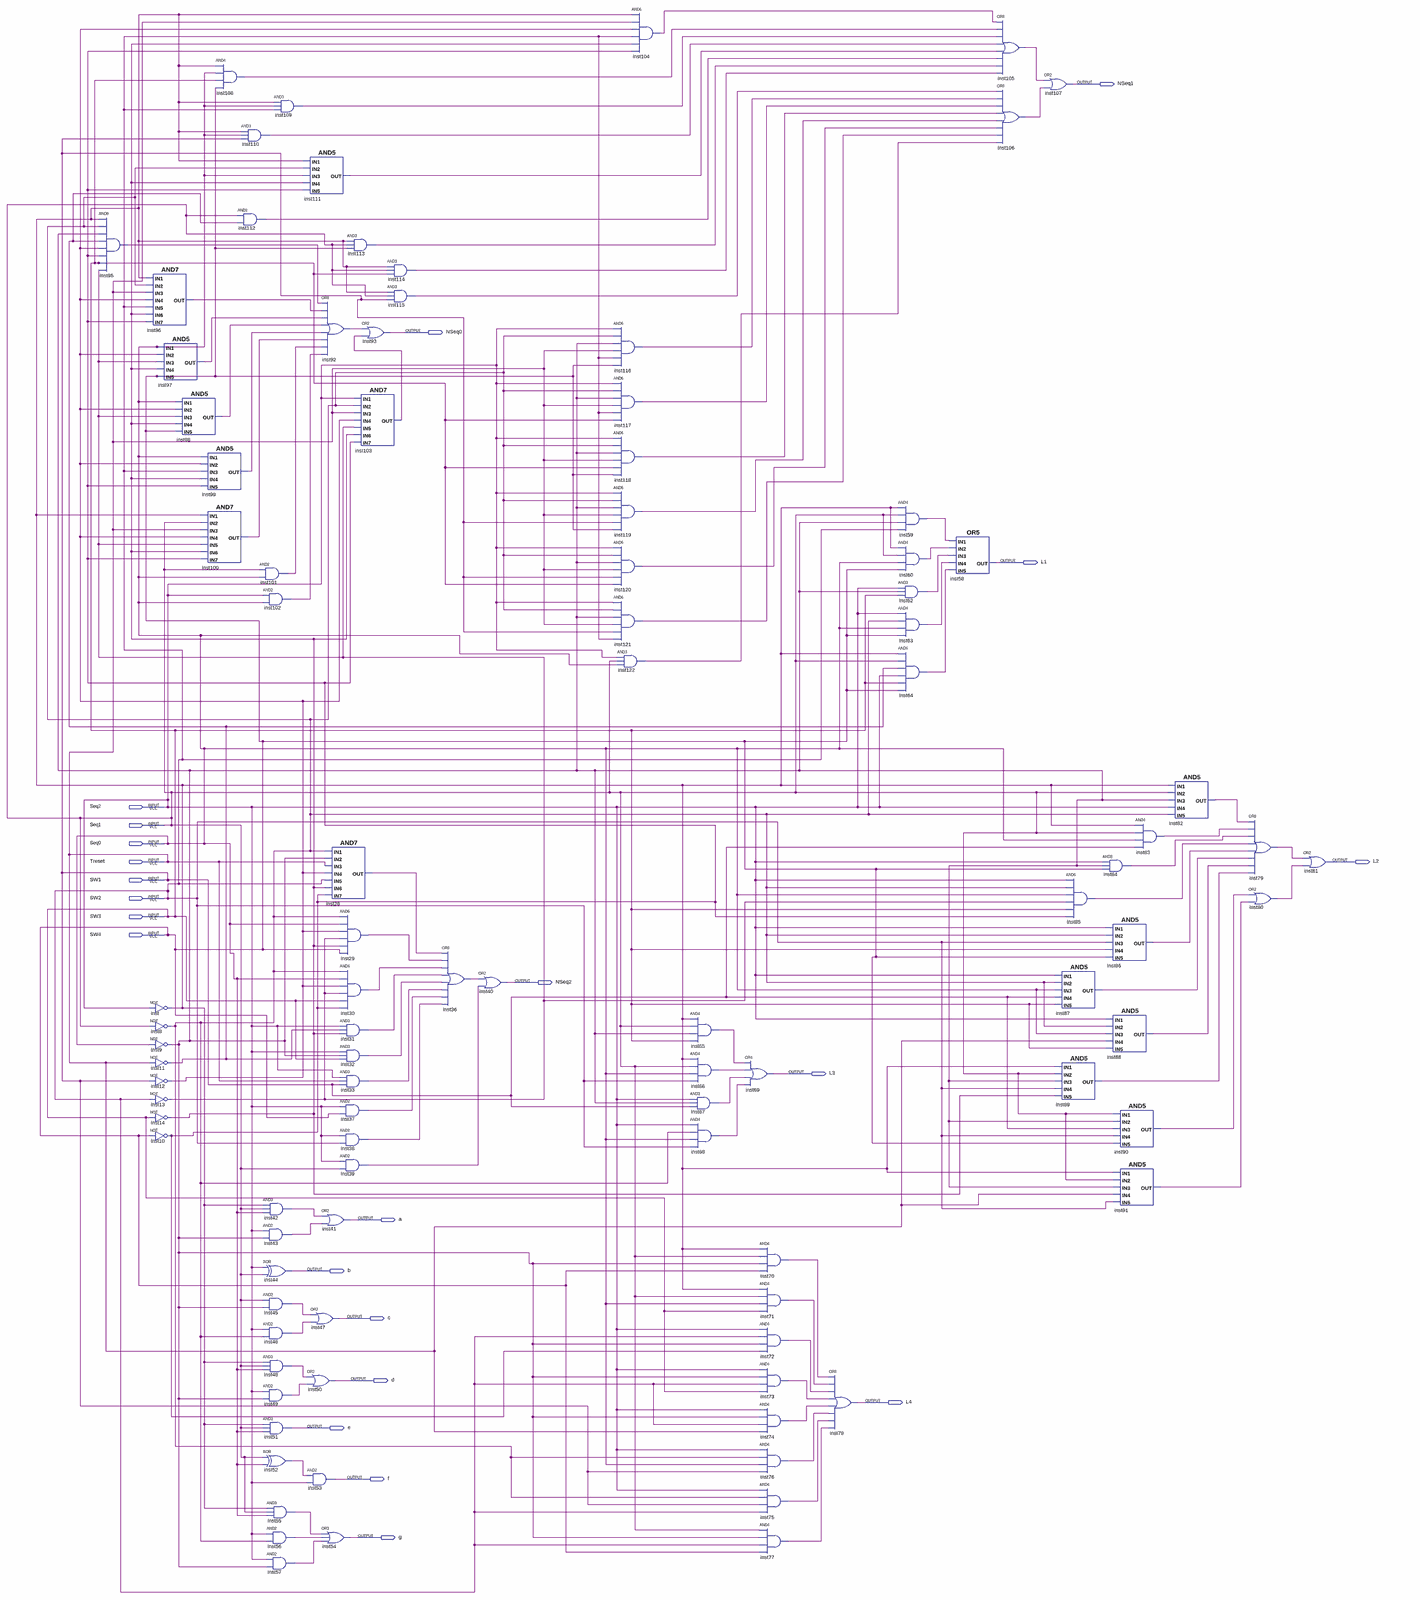
[diagram p0: schematic sheet, whole]
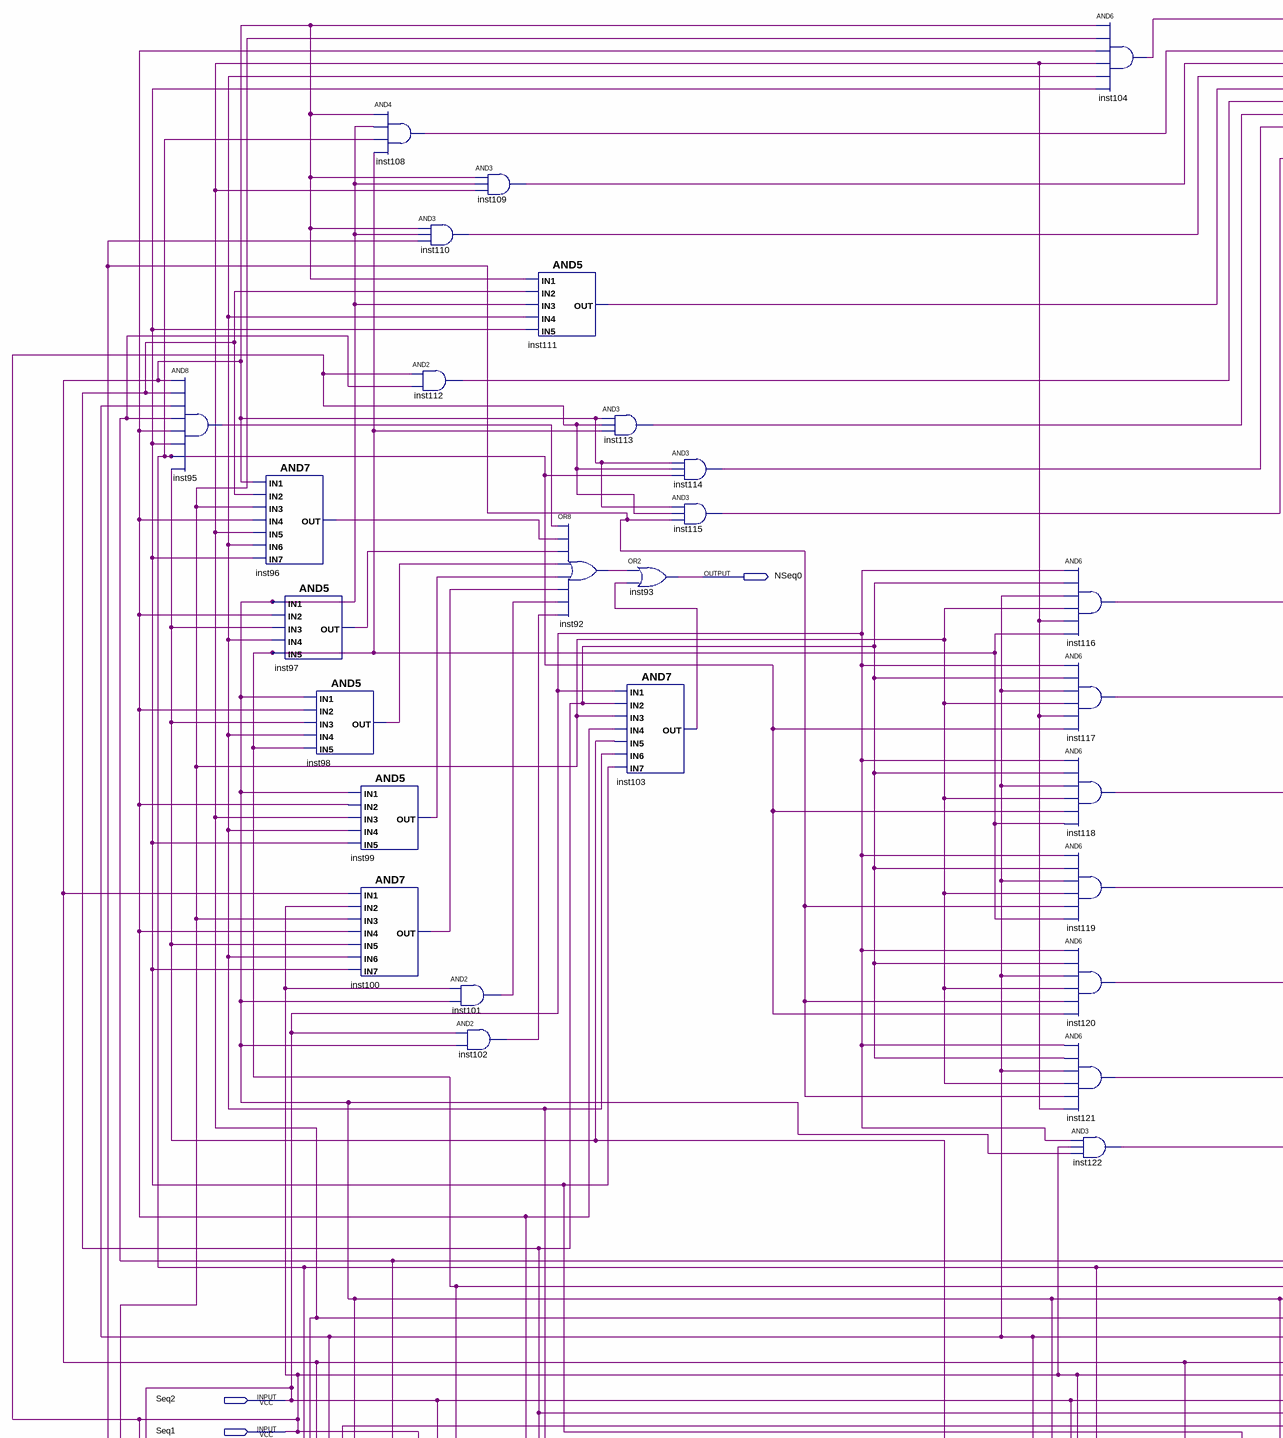
[diagram p1: schematic sheet, upper left part]
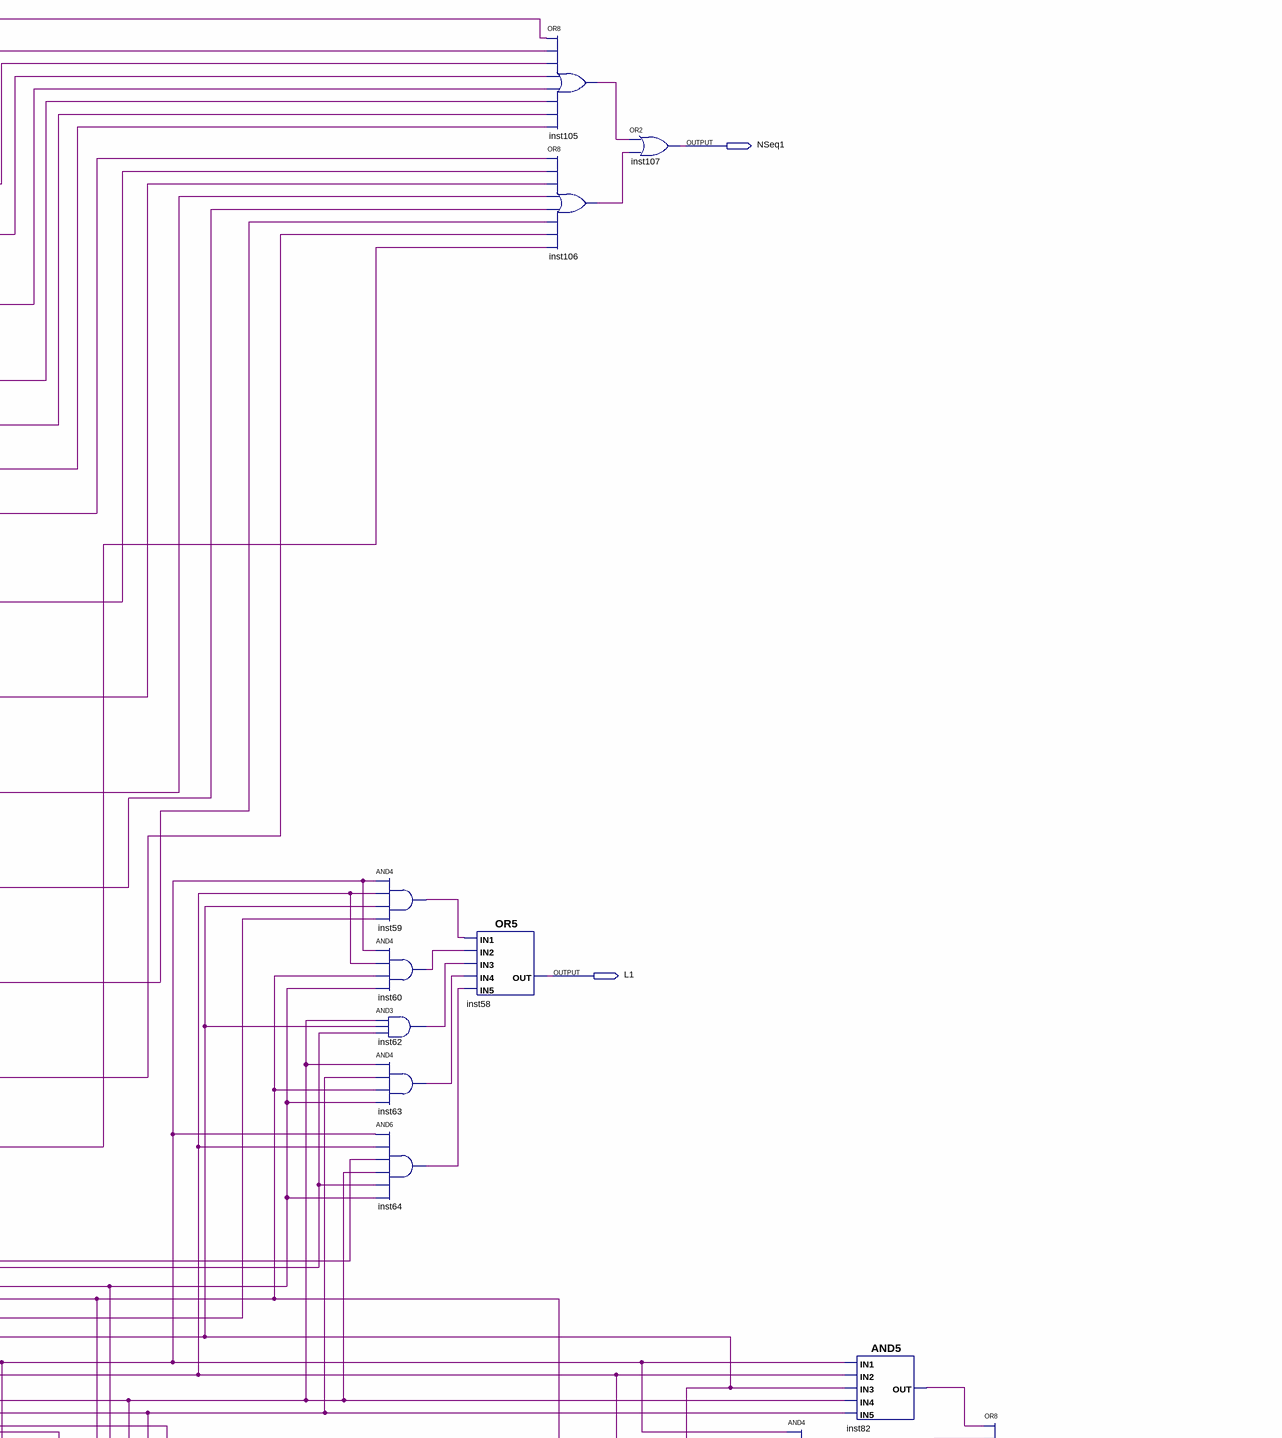
[diagram p2: schematic sheet, upper right part]
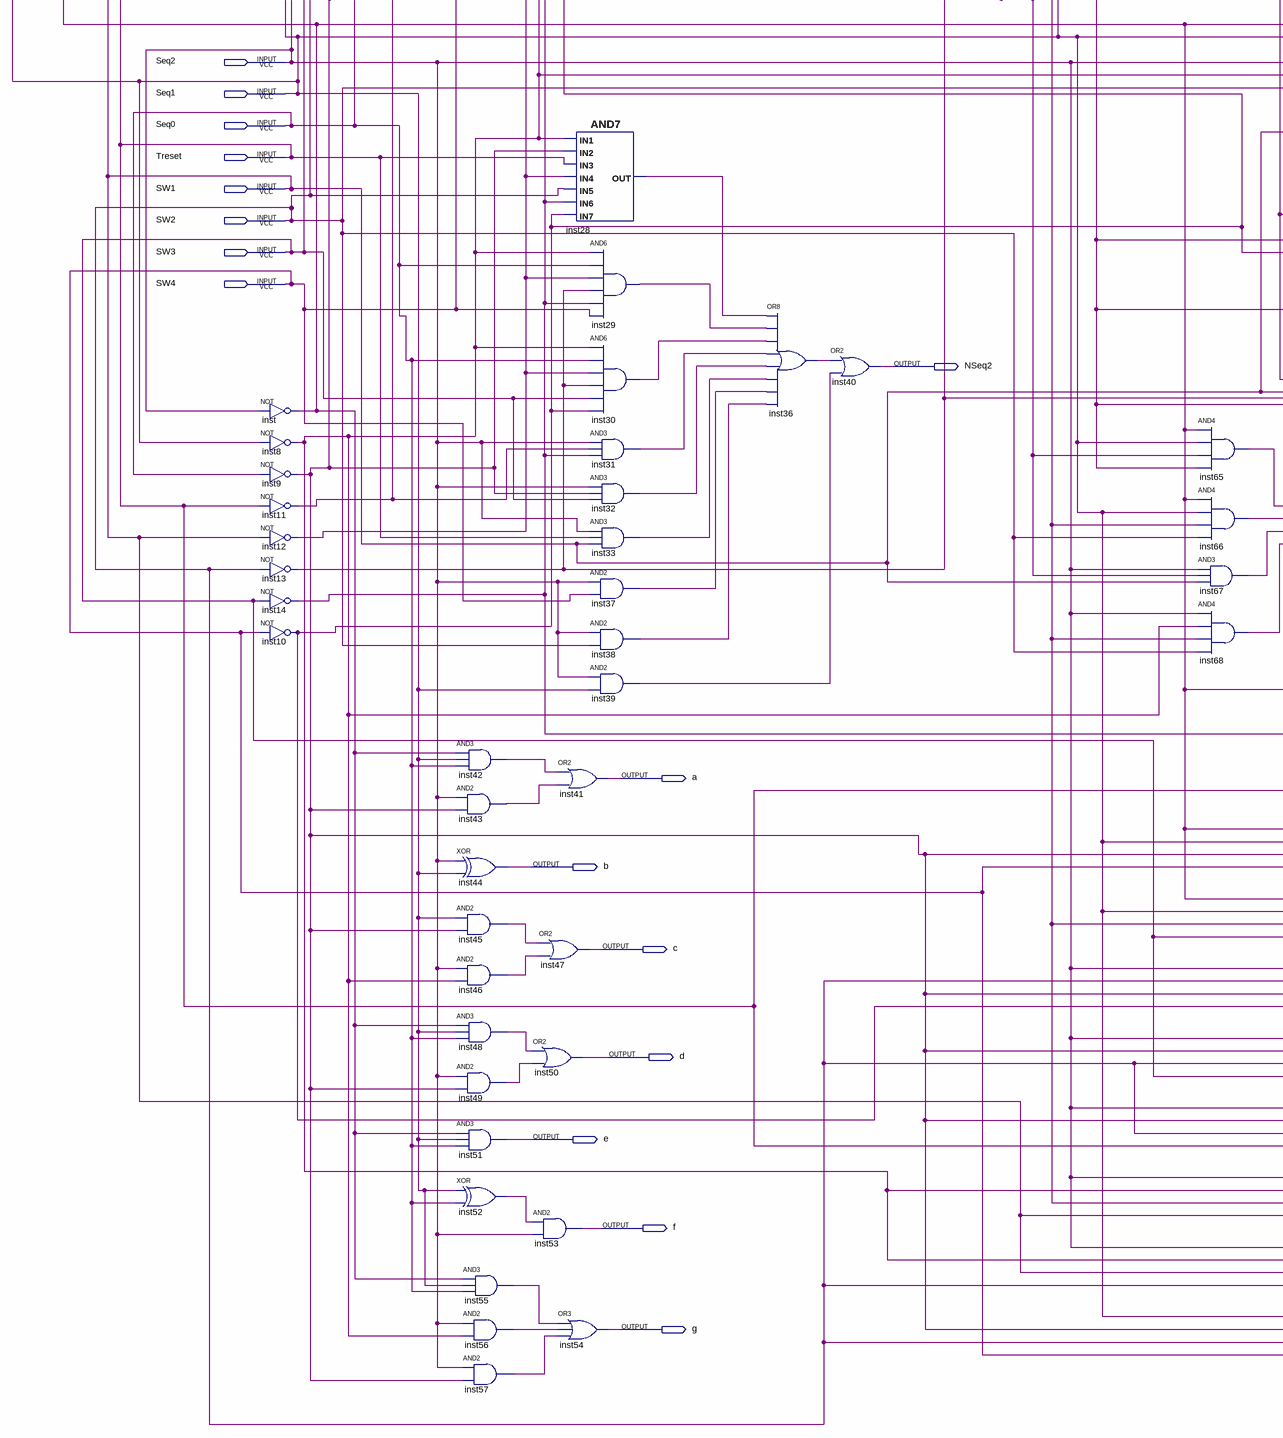
[diagram p3: schematic sheet, lower left part]
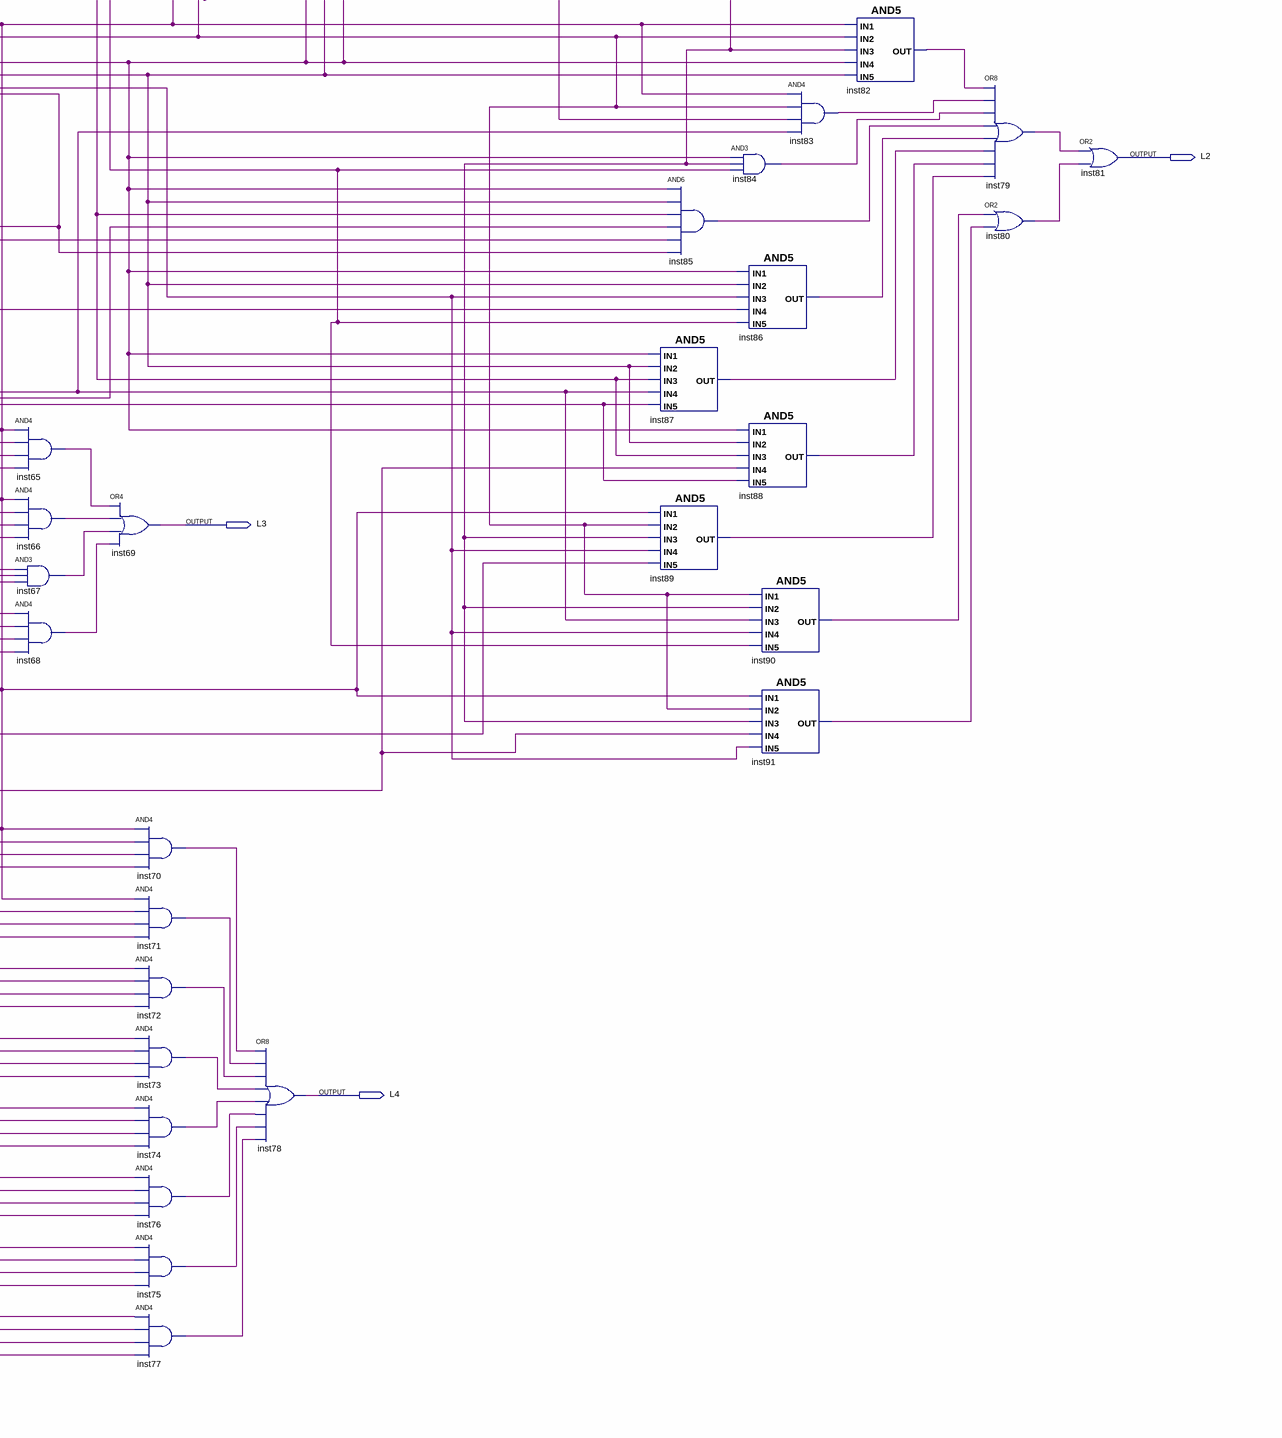
[diagram p4: schematic sheet, lower right part]
// Quartus schematic FinalProject.bdf as structural Verilog: 99 symbols, 22 pins
module FinalProject (
  input  Seq2,
  input  Seq1,
  input  Seq0,
  input  Treset,
  input  SW1,
  input  SW2,
  input  SW3,
  input  SW4,
  output NSeq1,
  output NSeq0,
  output L1,
  output L2,
  output NSeq2,
  output L3,
  output a,
  output b,
  output c,
  output d,
  output L4,
  output e,
  output f,
  output g
);

  wire inst8_out, inst9_out, inst10_out, inst11_out, inst12_out, inst13_out, inst14_out, inst28_out,
       inst29_out, inst30_out, inst31_out, inst32_out, inst33_out, inst36_out, inst37_out, inst38_out,
       inst39_out, inst42_out, inst43_out, inst45_out, inst46_out, inst48_out, inst49_out, inst52_out,
       inst55_out, inst56_out, inst57_out, inst59_out, inst60_out, inst62_out, inst63_out, inst64_out,
       inst65_out, inst66_out, inst67_out, inst68_out, inst70_out, inst71_out, inst72_out, inst73_out,
       inst74_out, inst75_out, inst76_out, inst77_out, inst79_out, inst80_out, inst82_out, inst83_out,
       inst84_out, inst85_out, inst86_out, inst87_out, inst88_out, inst89_out, inst90_out, inst91_out,
       inst92_out, inst95_out, inst96_out, inst97_out, inst98_out, inst99_out, inst100_out, inst101_out,
       inst102_out, inst103_out, inst104_out, inst105_out, inst106_out, inst108_out, inst109_out,
       inst110_out, inst111_out, inst112_out, inst113_out, inst114_out, inst115_out, inst116_out,
       inst117_out, inst118_out, inst119_out, inst120_out, inst121_out, inst122_out, inst_out;

  and inst95 (inst95_out, inst_out, inst8_out, inst9_out, inst11_out, inst12_out, inst10_out, SW3, inst13_out);
  and inst96 (inst96_out, inst_out, inst8_out, Treset, inst12_out, SW2, inst14_out, inst10_out);
  and inst97 (inst97_out, Seq0, inst12_out, inst13_out, inst14_out, SW4);
  not inst (inst_out, Seq2);
  not inst8 (inst8_out, Seq1);
  not inst9 (inst9_out, Seq0);
  not inst11 (inst11_out, Treset);
  not inst12 (inst12_out, SW1);
  not inst13 (inst13_out, SW2);
  not inst14 (inst14_out, SW3);
  not inst10 (inst10_out, SW4);
  and inst98 (inst98_out, Seq0, inst12_out, inst13_out, inst14_out, SW4);
  and inst108 (inst108_out, inst_out, Seq0, SW3, SW4);
  and inst99 (inst99_out, Seq0, inst12_out, SW2, inst14_out, inst10_out);
  and inst100 (inst100_out, inst_out, Seq1, Treset, inst12_out, inst13_out, inst14_out, inst10_out);
  and inst110 (inst110_out, inst_out, Seq0, SW1);
  and inst112 (inst112_out, Seq1, inst11_out);
  and inst109 (inst109_out, inst_out, Seq0, SW2);
  and inst101 (inst101_out, Seq1, Seq0);
  and inst102 (inst102_out, Seq2, Seq0);
  and inst42 (inst42_out, inst_out, Seq1, Seq0);
  and inst43 (inst43_out, Seq2, inst9_out);
  xor inst44 (b, Seq2, Seq1);
  and inst45 (inst45_out, Seq1, inst9_out);
  and inst46 (inst46_out, Seq2, inst8_out);
  and inst48 (inst48_out, inst_out, Seq1, Seq0);
  and inst49 (inst49_out, Seq2, inst9_out);
  and inst51 (e, inst_out, Seq1, Seq0);
  xor inst52 (inst52_out, Seq1, Seq0);
  and inst55 (inst55_out, inst_out, Seq1, Seq0);
  and inst56 (inst56_out, Seq2, inst8_out);
  and inst57 (inst57_out, Seq2, inst9_out);
  and inst111 (inst111_out, inst_out, inst8_out, Seq0, inst14_out, inst10_out);
  or inst50 (d, inst48_out, inst49_out);
  and inst53 (f, inst52_out, Seq2);
  or inst92 (inst92_out, inst95_out, inst96_out, inst97_out, inst98_out, inst99_out, inst100_out, inst101_out, inst102_out);
  and inst28 (inst28_out, inst8_out, inst9_out, Treset, inst12_out, SW2, inst14_out, inst10_out);
  or inst41 (a, inst42_out, inst43_out);
  or inst47 (c, inst45_out, inst46_out);
  or inst54 (g, inst55_out, inst56_out, inst57_out);
  and inst113 (inst113_out, inst_out, Seq1, SW4);
  or inst93 (NSeq0, inst92_out, inst103_out);
  and inst103 (inst103_out, Seq2, inst8_out, Treset, inst12_out, inst13_out, inst14_out, inst10_out);
  and inst29 (inst29_out, inst8_out, Seq0, inst12_out, inst13_out, inst14_out, SW4);
  and inst30 (inst30_out, inst8_out, Seq0, inst12_out, inst13_out, SW3, inst10_out);
  and inst31 (inst31_out, Seq2, inst11_out, inst14_out);
  and inst32 (inst32_out, Seq2, inst9_out, SW3);
  and inst33 (inst33_out, Seq2, Treset, SW1);
  and inst37 (inst37_out, Seq2, SW4);
  and inst38 (inst38_out, Seq2, SW2);
  and inst39 (inst39_out, Seq2, Seq1);
  and inst114 (inst114_out, inst_out, Seq1, SW3);
  and inst115 (inst115_out, inst_out, Seq1, SW1);
  or inst36 (inst36_out, inst28_out, inst29_out, inst30_out, inst31_out, inst32_out, inst33_out, inst37_out, inst38_out);
  or inst40 (NSeq2, inst36_out, inst39_out);
  and inst116 (inst116_out, Seq2, inst8_out, inst9_out, Treset, SW2, SW4);
  and inst117 (inst117_out, Seq2, inst8_out, inst9_out, Treset, SW2, SW3);
  and inst118 (inst118_out, Seq2, inst8_out, inst9_out, Treset, SW3, SW4);
  and inst119 (inst119_out, Seq2, inst8_out, inst9_out, Treset, SW1, SW4);
  and inst120 (inst120_out, Seq2, inst8_out, inst9_out, Treset, SW1, SW3);
  and inst121 (inst121_out, Seq2, inst8_out, inst9_out, Treset, SW1, SW2);
  and inst122 (inst122_out, Seq2, Seq1, Seq0);
  and inst104 (inst104_out, inst_out, Treset, inst12_out, SW2, inst14_out, inst10_out);
  and inst65 (inst65_out, inst_out, Seq1, inst9_out, SW3);
  and inst66 (inst66_out, inst_out, Seq1, Seq0, SW2);
  and inst67 (inst67_out, Seq2, inst9_out, SW1);
  and inst68 (inst68_out, Seq2, inst8_out, Seq0, SW2);
  or inst69 (L3, inst65_out, inst66_out, inst67_out, inst68_out);
  and inst70 (inst70_out, inst_out, Seq1, inst9_out, SW4);
  and inst71 (inst71_out, inst_out, Seq1, Seq0, SW3);
  and inst72 (inst72_out, Seq2, SW2, inst9_out, inst10_out);
  and inst73 (inst73_out, Seq2, inst9_out, SW2, SW3);
  and inst74 (inst74_out, Seq2, inst9_out, SW2, Treset);
  and inst76 (inst76_out, Seq2, inst8_out, Seq0, SW1);
  and inst75 (inst75_out, Seq2, inst8_out, SW1, SW2);
  and inst77 (inst77_out, Seq1, inst9_out, SW2, SW4);
  or inst78 (L4, inst70_out, inst71_out, inst72_out, inst73_out, inst74_out, inst76_out, inst75_out, inst77_out);
  and inst59 (inst59_out, inst_out, Seq1, inst9_out, SW2);
  and inst60 (inst60_out, inst_out, Seq1, Seq0, SW4);
  and inst62 (inst62_out, Seq2, inst9_out, SW3);
  and inst63 (inst63_out, Seq2, inst8_out, Seq0, SW4);
  and inst64 (inst64_out, inst_out, Seq1, inst11_out, Seq2, SW3, SW4);
  or inst58 (L1, inst59_out, inst60_out, inst62_out, inst63_out, inst64_out);
  or inst105 (inst105_out, inst104_out, inst108_out, inst109_out, inst110_out, inst111_out, inst112_out, inst113_out, inst114_out);
  or inst106 (inst106_out, inst115_out, inst116_out, inst117_out, inst118_out, inst119_out, inst120_out, inst121_out, inst122_out);
  or inst107 (NSeq1, inst105_out, inst106_out);
  and inst85 (inst85_out, Seq2, inst8_out, Seq0, inst13_out, SW3, inst10_out);
  and inst87 (inst87_out, Seq2, inst8_out, Seq0, SW1, SW3);
  and inst89 (inst89_out, inst_out, Seq1, inst9_out, SW2, inst14_out);
  and inst84 (inst84_out, Seq2, inst9_out, SW4);
  and inst86 (inst86_out, Seq2, inst8_out, SW2, SW3, SW4);
  and inst88 (inst88_out, Seq2, inst8_out, Seq0, Treset, SW3);
  and inst90 (inst90_out, Seq1, inst9_out, SW1, SW2, SW4);
  and inst91 (inst91_out, inst_out, Seq1, inst9_out, Treset, SW2);
  and inst83 (inst83_out, inst_out, Seq1, Seq0, SW1);
  and inst82 (inst82_out, inst_out, Seq1, inst9_out, Seq2, inst8_out);
  or inst79 (inst79_out, inst82_out, inst83_out, inst84_out, inst85_out, inst86_out, inst87_out, inst88_out, inst89_out);
  or inst80 (inst80_out, inst90_out, inst91_out);
  or inst81 (L2, inst79_out, inst80_out);
endmodule
